# Altium schematic sheet Sheet1.SchDoc
size A; SheetNumber: 1; SheetTotal: 1
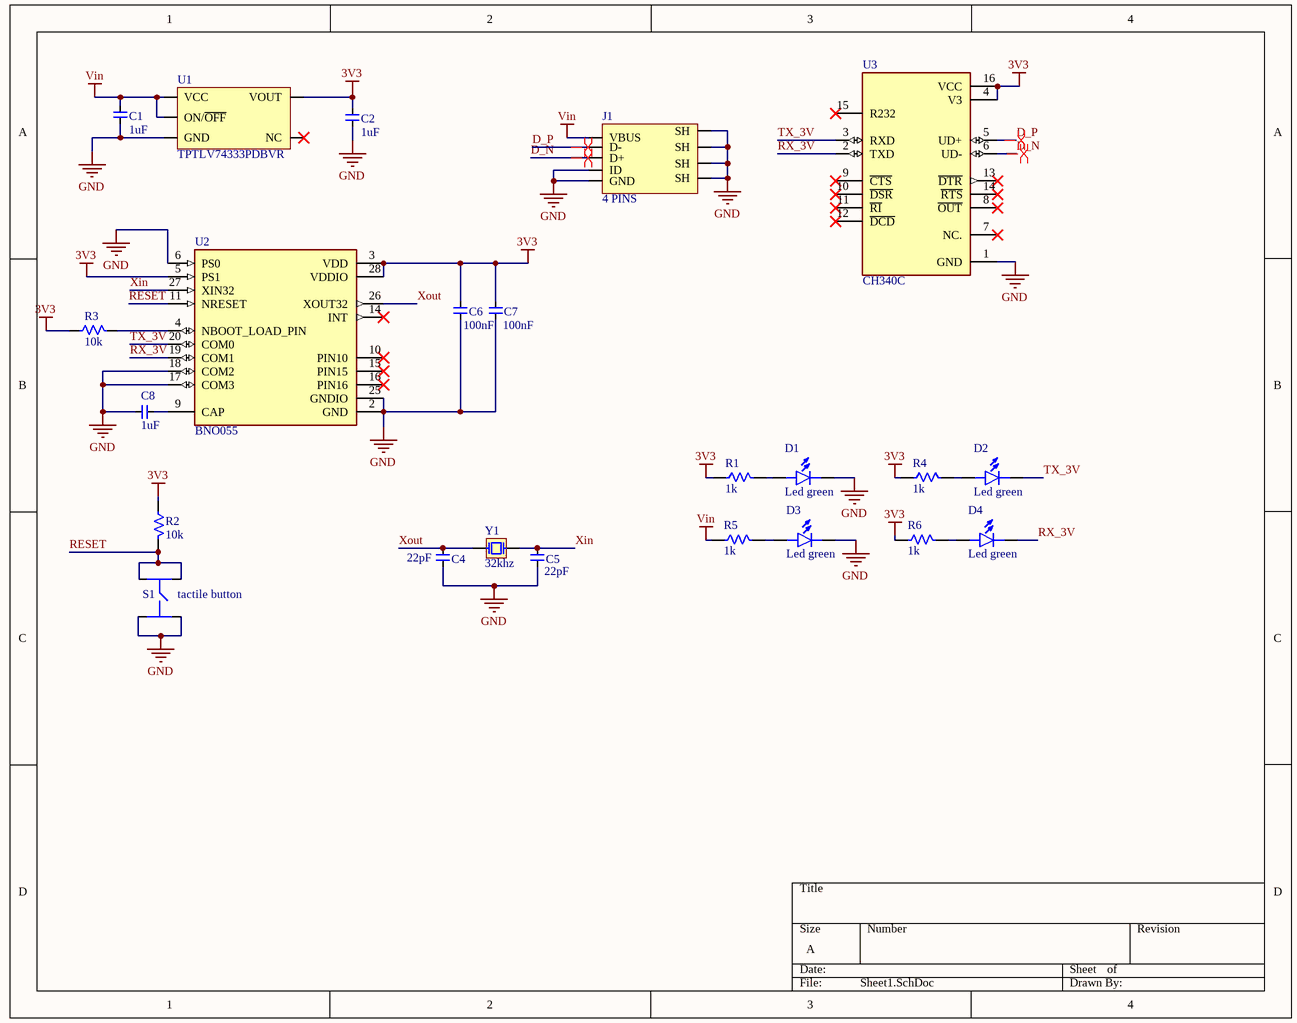
[diagram p0: Sheet1.SchDoc]

## Parts
C1  1uF  [0603 cap]
C2  1uF  [0603 cap]
C4  22pF  [0603 cap]
C5  22pF  [0603 cap]
C6  100nF  [0603 cap]
C7  100nF  [0603 cap]
C8  1uF  [0603 cap]
D1  Led green  [0805led]
D2  Led green  [0805led]
D3  Led green  [0805led]
D4  Led green  [0805led]
J1  4 PINS  [Micro USB]
R1  1k  [0603 res]
R2  10k  [0603 res]
R3  10k  [0603 res]
R4  1k  [0603 res]
R5  1k  [0603 res]
R6  1k  [0603 res]
S1  tactile button  [button]
U1  TPTLV74333PDBVR  [SOT-23]
U2  BNO055  [LGA28R50P4X10_380X520X100]
U3  CH340C  [sop 16]
Y1  32khz  [XTAL_ABS06-107-32.768KHZ-T]

## Nets
3V3: C2.2 C6.2 C7.2 R1.1 R2.1 R3.1 R4.1 R6.1 U1.5(VOUT) U2.3(VDD) U2.5(PS1) U2.28(VDDIO) U3.4(V3) U3.16(VCC)
GND: C1.1 C2.1 C4.1 C5.1 C6.1 C7.1 C8.2 D1.2 D3.2 J1.4(ID) J1.5(GND) J1.6(SH) J1.7(SH) J1.8(SH) J1.9(SH) S1.A S1.B U1.2(GND) U2.2(GND) U2.6(PS0) U2.17(COM3) U2.18(COM2) U2.25(GNDIO) U3.1(GND)
Vin: C1.2 J1.1(VBUS) R5.1 U1.1(VCC) U1.3(ON/~{OFF})
D_N: J1.3(D+) U3.6(UD-)
D_P: J1.2(D-) U3.5(UD+)
RESET: R2.2 S1.C S1.D U2.11(NRESET)
RX_3V: D4.2 U2.19(COM1) U3.2(TXD)
TX_3V: D2.2 U2.20(COM0) U3.3(RXD)
Xin: C5.2 U2.27(XIN32) Y1.2
Xout: C4.2 U2.26(XOUT32) Y1.1
NetC8_1: C8.1 U2.9(CAP)
NetD1_1: D1.1 R1.2
NetD2_1: D2.1 R4.2
NetD3_1: D3.1 R5.2
NetD4_1: D4.1 R6.2
NetR3_2: R3.2 U2.4(NBOOT_LOAD_PIN)

Not connected (* = marked no-connect by the designer): U1 4(NC)*; U2 10(PIN10)* 14(INT)* 15(PIN15)* 16(PIN16)*; U3 7(NC.)* 8(~{OUT})* 9(~{CTS})* 10(~{DSR})* 11(~{RI})* 12(~{DCD})* 13(~{DTR})* 14(~{RTS})* 15(R232)*

## Layout directives
differential pair: D_N, D_P

## Library data of the parts
C1 C2 C8 = 1uF: 25V 1uF X7R ±10% 0603 Multilayer Ceramic Capacitors MLCC - SMD/SMT ROHS; Manufacturer: PSA(Prosperity Dielectrics); Mfr. Part #: FS18X105K250PBG; supplier: LCSC; LCSC Part #: C525333
C4 C5 = 22pF capacitor: 50V 22pF C0G ±5% 0603 Multilayer Ceramic Capacitors MLCC - SMD/SMT ROHS; Manufacturer: PSA(Prosperity Dielectrics); Mfr. Part #: FN18N220J500PSG; supplier: LCSC; LCSC Part #: C525244
C6 C7 = 100nF capacitor: 50V 100nF X7R ±10% 0603 Multilayer Ceramic Capacitors MLCC - SMD/SMT ROHS; Manufacturer: PSA(Prosperity Dielectrics); Mfr. Part #: FN18X104K500PBG; supplier: LCSC; LCSC Part #: C235731
D1-D4 = Led green: Emerald 0805 Light Emitting Diodes (LED) ROHS; Manufacturer: Yongyu Photoelectric; Mfr. Part #: SZYY0805G; supplier: LCSC; LCSC Part #: C434432
J1 = Micro USB: 1.8A USB 2.0 1 Horizontal attachment 5P Mother -20℃~+85℃ Micro-B SMD USB Connectors ROHS; Manufacturer: SHOU HAN; Mfr. Part #: MicroXNJ; supplier: LCSC; LCSC Part #: C404969
R1 R4-R6 = 1k resistor: 100mW Thick Film Resistors 75V ±100ppm/℃ ±1% 1kΩ 0603 Chip Resistor - Surface Mount ROHS; Manufacturer: UNI-ROYAL(Uniroyal Elec); Mfr. Part #: 0603WAF1001T5E; supplier: LCSC; LCSC Part #: C21190
R2 R3 = 10k resistor: 100mW Thick Film Resistors 75V ±100ppm/℃ ±1% 10kΩ 0603 Chip Resistor - Surface Mount ROHS; Manufacturer: UNI-ROYAL(Uniroyal Elec); Mfr. Part #: 0603WAF1002T5E; supplier: LCSC; LCSC Part #: C25804
S1 = Button: None Without 50mA 5.1mm 100000 Times 160gf 12V 5.1mm 1.5mm Round Button Standing paste SPST SMD Tactile Switches ROHS; Manufacturer: XKB Connection; Mfr. Part #: UK-B0240-R-250; supplier: LCSC; LCSC Part #: C318884
U1 = TPTLV74333PDBVR: 75dB@(1kHz) 300mA Fixed 3.3V Positive electrode 5.5V SOT-23-5 Voltage Regulators - Linear, Low Drop Out (LDO) Regulators ROHS; Manufacturer: TECH PUBLIC; Mfr. Part #: TPTLV74333PDBVR; Supplier: LCSC; LCSC Part #: C3021096
U2 = BNO055: LGA-28(3.8x5.2) Accelerometers ROHS; Manufacturer: Bosch Sensortec; Mfr. Part #: BNO055; Supplier: LCSC; LCSC Part #: C93216
U3 = CH340C: 2Mbps Transceiver USB 2.0 SOP-16 USB ICs ROHS; Manufacturer: WCH; Mfr. Part #: CH340C; supplier: LCSC; LCSC Part #: C84681
Y1 = 32khz: 32.768kHz 6pF ±10ppm SMD2012-2P Crystals ROHS; Manufacturer: Abracon LLC; Mfr. Part #: ABS06-32.768KHZ-6-1-T; supplier: LCSC; LCSC Part #: C3015107